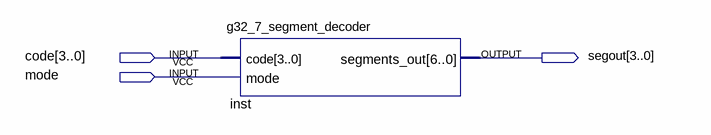
[diagram p0: schematic sheet]
// Quartus schematic test.bdf as structural Verilog: 1 symbols, 3 pins
module test (
  input  [3:0] code,
  input  mode,
  output [3:0] segout
);

  g32_7_segment_decoder inst (.code(code), .mode(mode), .segments_out(segout));
endmodule
